# Altium schematic sheet main.SchDoc
size A4; SheetNumber: 1; SheetTotal: 1
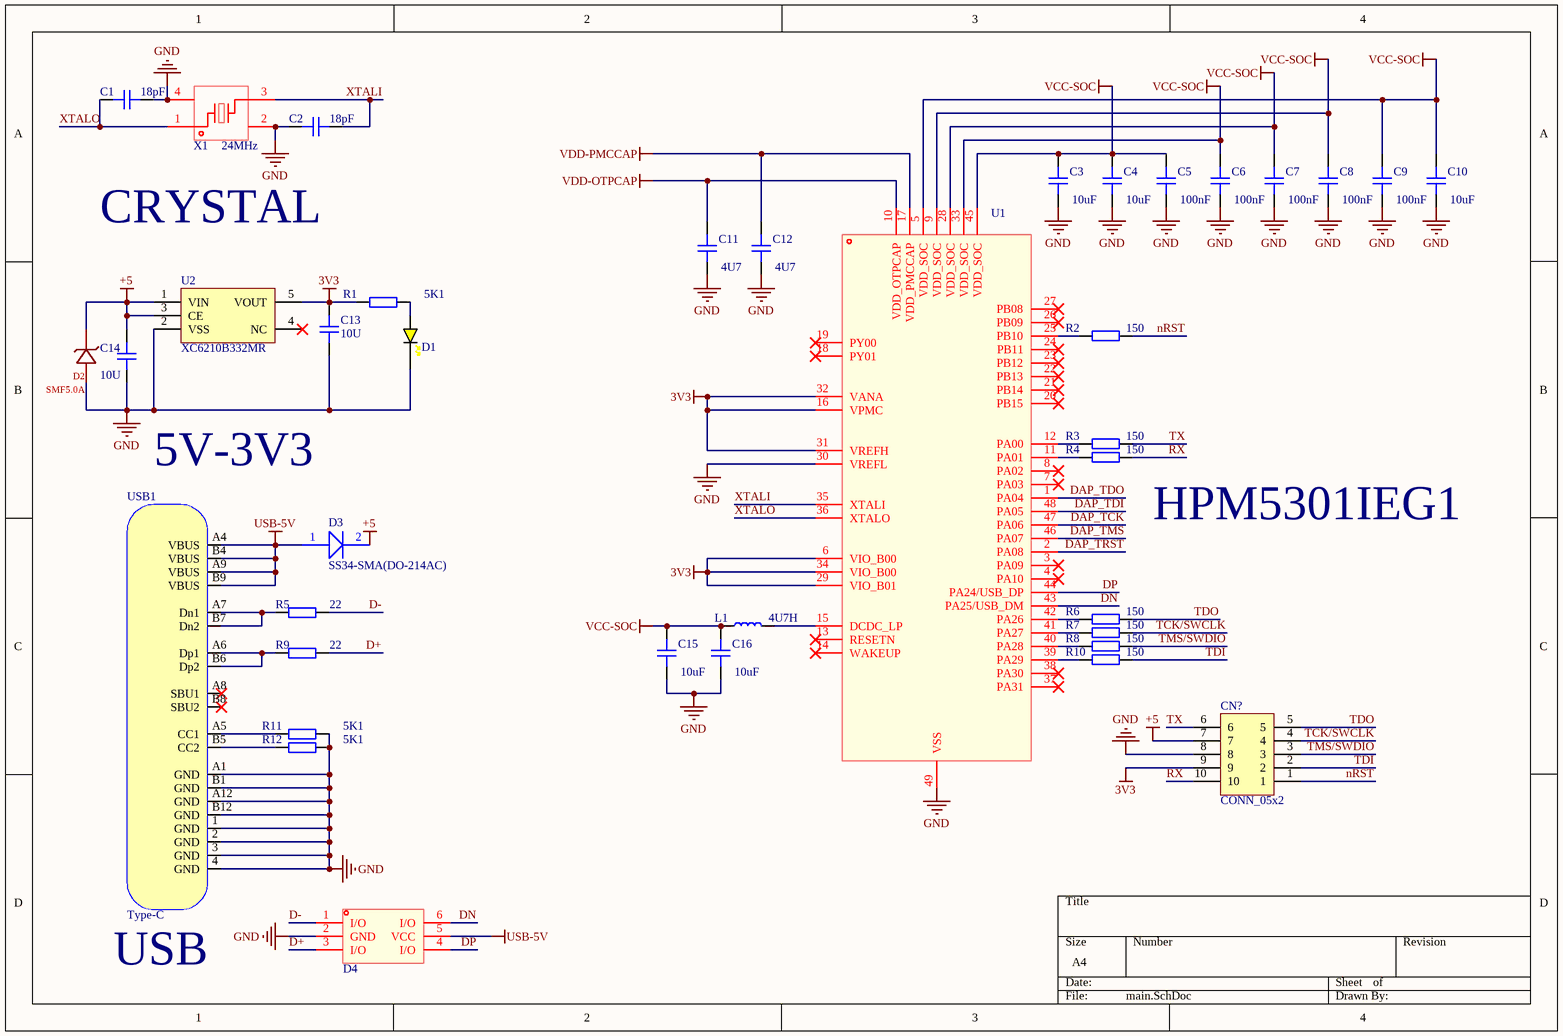
[diagram p0: main.SchDoc]

## Parts
C1  18pF  [CAP_0402]
C2  18pF  [CAP_0402]
C3  10uF  [CAP_0402]
C4  10uF  [CAP_0402]
C5  100nF  [CAP_0402]
C6  100nF  [CAP_0402]
C7  100nF  [CAP_0402]
C8  100nF  [CAP_0402]
C9  100nF  [CAP_0402]
C10  10uF  [CAP_0402]
C11  4U7  [CAP_0402]
C12  4U7  [CAP_0402]
C13  10U  [CAP_0402]
C14  10U  [CAP_0402]
C15  10uF  [CAP_0402]
C16  10uF  [CAP_0402]
CN?  CONN_05x2  [CONN_05x2_2.54_SMD]
D1  YELLOW  [LED_0402_YELLOW]  (value not drawn)
D2  SMF5.0A  [SOD-123FL_L2.7-W1.8-LS3.8-RD]
D3  SS34-SMA(DO-214AC)  [SMA_L4.3-W2.6-LS5.0-FD]
D4  BST236A054U  [SOT-23-6_L2.9-W1.6-P0.95-LS2.9-BL]  (value not drawn)
L1  4U7H  [IND_1008]
R1  5K1  [RES_0402]
R2  150  [RES_0402]
R3  150  [RES_0402]
R4  150  [RES_0402]
R5  22  [RES_0402]
R6  150  [RES_0402]
R7  150  [RES_0402]
R8  150  [RES_0402]
R9  22  [RES_0402]
R10  150  [RES_0402]
R11  5K1  [RES_0402]
R12  5K1  [RES_0402]
U1  HPM5301IEG1  [QFN-48_L6.0-W6.0-P0.40-TL-EP4.2]  (value not drawn)
U2  XC6210B332MR  [SOT-23-5]
USB1  Type-C  [TYPE-C_16P]
X1  24MHz  [CRYSTAL-SMD_4P-L2.5-W2.0-BL-A]

## Nets
3V3: C13.2 CN?.9 R1.1 U1.6(VIO_B00) U1.16(VPMC) U1.29(VIO_B01) U1.31(VREFH) U1.32(VANA) U1.34(VIO_B00) U2.5(VOUT)
+5: C14.2 CN?.7 D2.1(K) D3.2 U2.1(VIN) U2.3(CE)
GND: C1.1 C2.2 C3.1 C4.1 C5.1 C6.1 C7.1 C8.1 C9.1 C10.1 C11.1 C12.1 C13.1 C14.1 C15.1 C16.1 CN?.8 D1.K D2.2(A) D4.2(GND) R11.2 R12.2 U1.30(VREFL) U1.49(VSS) U2.2(VSS) USB1.1(GND) USB1.2(GND) USB1.3(GND) USB1.4(GND) USB1.A1(GND) USB1.A12(GND) USB1.B1(GND) USB1.B12(GND) X1.2(GND) X1.4(GND)
USB-5V: D3.1 D4.5(VCC) USB1.A4(VBUS) USB1.A9(VBUS) USB1.B4(VBUS) USB1.B9(VBUS)
VCC-SOC: C3.2 C4.2 C5.2 C6.2 C7.2 C8.2 C9.2 C10.2 C15.2 C16.2 L1.1 U1.5(VDD_SOC) U1.9(VDD_SOC) U1.28(VDD_SOC) U1.33(VDD_SOC) U1.45(VDD_SOC)
VDD-OTPCAP: C11.2 U1.10(VDD_OTPCAP)
VDD-PMCCAP: C12.2 U1.17(VDD_PMCCAP)
D+: D4.3(I/O) R9.2
D-: D4.1(I/O) R5.2
DAP_TCK: U1.47(PA06)
DAP_TDI: U1.48(PA05)
DAP_TDO: U1.1(PA04)
DAP_TMS: U1.46(PA07)
DAP_TRST: U1.2(PA08)
DN: D4.6(I/O) U1.43(PA25/USB_DM)
DP: D4.4(I/O) U1.44(PA24/USB_DP)
nRST: CN?.1 R2.2
RX: CN?.10 R4.2
TCK/SWCLK: CN?.4 R7.2
TDI: CN?.2 R10.2
TDO: CN?.5 R6.2
TMS/SWDIO: CN?.3 R8.2
TX: CN?.6 R3.2
XTALI: C2.1 U1.35(XTALI) X1.3
XTALO: C1.2 U1.36(XTALO) X1.1
NetD1_A: D1.A R1.2
NetL1_2: L1.2 U1.15(DCDC_LP)
NetR2_1: R2.1 U1.25(PB10)
NetR3_1: R3.1 U1.12(PA00)
NetR4_1: R4.1 U1.11(PA01)
NetR5_1: R5.1 USB1.A7(Dn1) USB1.B7(Dn2)
NetR6_1: R6.1 U1.42(PA26)
NetR7_1: R7.1 U1.41(PA27)
NetR8_1: R8.1 U1.40(PA28)
NetR9_1: R9.1 USB1.A6(Dp1) USB1.B6(Dp2)
NetR10_1: R10.1 U1.39(PA29)
NetR11_1: R11.1 USB1.A5(CC1)
NetR12_1: R12.1 USB1.B5(CC2)

Not connected (* = marked no-connect by the designer): U1 3(PA09)* 4(PA10)* 7(PA03)* 8(PA02)* 13(RESETN)* 14(WAKEUP)* 18(PY01)* 19(PY00)* 20(PB15)* 21(PB14)* 22(PB13)* 23(PB12)* 24(PB11)* 26(PB09)* 27(PB08)* 37(PA31)* 38(PA30)*; U2 4(NC)*; USB1 A8(SBU1)* B8(SBU2)*

## Notes on the sheet
- CRYSTAL
- 5V-3V3
- HPM5301IEG1
- USB

## Library data of the parts
C1-C16 = CAP_0402: Capacitor SMD 0402; Manufacturer: *; Manufacturer Part Number: *; Distributor Link: *; LCSC: *; Rating: *; Dielectric: *
CN? = CONN_05x2: CONN_05x2 2.54MM
D1 = LED_0402_YELLOW: LED 0402 YELLOW SMD
D2 = SMF5.0A_C19077497: 极性:单向;反向截止电压(Vrwm):5V;钳位电压:9.2V;峰值脉冲电流(Ipp):21.7A@10/1000us;峰值脉冲功率(Ppp):200W@10/1000us;击穿电压:7V;; Manufacturer: R+O(宏嘉诚); AddInBom: yes; ModelId: 86f9151e155e4fe2af0c4f2e0a80302e聨0819f05c4eef4c71ace90d822a990e87; ModelName: SOD-123FL_L2.8-W1.8-H1.1-LS3.6; ModelTransform: 141.732,70.866,0,180,0,0,0,0,0; Polarity: 单向; Reverse Stand-Off Voltage (Vrwm): 5V; Clamping Voltage: 9.2V; Voltage - Breakdown: 7V; Reverse Leakage Current (Ir): 400uA; Number of Channels: 单路; level of protection: IEC 61000-4-2; Type: TVS; Symbol: SMF5.0A_C19077497; Device: SMF5.0A_C19077497; LCSC Part Name: 单向TVS 5V截止 峰值浪涌电流：21.7A@10/1000us; SupplierPart: C19077497; ManufacturerPart: SMF5.0A; Supplier Footprint: SOD-123FL; JLCPCB Part Class: Extended Part; Datasheet: https://item.szlcsc.com/datasheet/SMF5.0A/20275582.html; Supplier: LCSC; ConvertToPcb: yes; FootprintName: SOD-123FL_L2.7-W1.8-LS3.8-RD; Peak Pulse Current (Ipp): 21.7A@10/1000us; Peak Pulse Power Dissipation (Ppp): 200W@10/1000us; Operating Temperature: -55℃~+150℃; Junction Capacitance: -
D3 = SS34-SMA(DO-214AC): 40V@3A
D4 = BST236A054U: 极性:-;反向截止电压(Vrwm):5V;钳位电压:13V;峰值脉冲电流(Ipp):3.5A;峰值脉冲功率(Ppp):45W@8/20us;击穿电压:6V;; Manufacturer: BORN(伯恩半导体); NPNP_COMPONENT_ID: C406203; Clamping Voltage: 13V; Junction Capacitance: 0.2pF；0.36pF; Number of Channels: 四路; Peak Pulse Current (Ipp): 3.5A; Reverse Leakage Current (Ir): 500nA; Reverse Stand-Off Voltage (Vrwm): 5V; Type: ESD; Voltage - Breakdown: 6V; level of protection: IEC 61000-4-4；IEC 61000-4-5；IEC 61000-4-2; Footprint: SOT-23-6_L2.9-W1.6-P0.95-LS2.8-BR; Datasheet: https://item.szlcsc.com/datasheet/BST236A054U/393966.html; JLCPCB Part Class: Extended Part; LCSC Part Name: ESD 5V截止 峰值浪涌电流：3.5A; Manufacturer Part: BST236A054U; Peak Pulse Power Dissipation (Ppp): 45W@8/20us; Supplier: LCSC; Supplier Footprint: SOT-23-6; Supplier Part: C406203
L1 = IND_1008: Inductor SMD 1008
R1-R12 = RES_0402: Resistor SMD 0402; Manufacturer: *; Manufacturer Part Number: *; Distributor Link: *; LCSC: *
U1 = HPM5301IEG1_C49451864: 特性：支持 RV32-IMAFDCBP 指令集。 3.57 Coremark/MHz, 1.98 DMIPS/MHz。 DSP 单元，支持 SIMD 和 DSP 指令。 L1 指令缓存和数据缓存各 16KB。 指令本地存储器 ILM 和数据本地存储器 DLM 各 128KB。 共 288KB 片上 SRAM，包括通用内存和 CPU 的本地存储器; Manufacturer: HPMICRO(先楫半导体); NPNP_COMPONENT_ID: C49451864; Datasheet: https://item.szlcsc.com/datasheet/HPM5301IEG1/51998746.html; JLCPCB Part Class: Extended Part; LCSC Part Name: 基于RISC-V内核的32位高性能微控制器; Manufacturer Part: HPM5301IEG1; Supplier: LCSC; Supplier Footprint: QFN-48(6x6); Supplier Part: C49451864
U2 = XC6210B332MR: LDO 3V3@700mA
USB1 = USB-Type-C: USB-Type-C_16P
X1 = XTAL_2520_24MHz: 晶振类型:贴片晶振;频率:24MHz;常温频差:±10ppm;负载电容:18pF;频率稳定度:±10ppm;; Manufacturer: HCI(杭晶); Manufacturer Part: XC22M4-32.000-F08NNHP; NPNP_COMPONENT_ID: C2842280; Equivalent Series Resistance(ESR): 60Ω; Frequency Stability: ±10ppm; Load Capacitance: 8pF; Value: 32MHz; Datasheet: https://item.szlcsc.com/datasheet/XC22M4-32.000-F08NNHP/3026554.html; JLCPCB Part Class: Extended Part; LCSC Part Name: 2520 4P 32MHz 8pF ±10ppm -20~+70℃ (±10ppm); Normal temperature Frequency Tolerance: ±10ppm; Operating Temperature: -20℃~+70℃; Supplier: LCSC; Supplier Footprint: SMD2520-4P; Supplier Part: C2842280; Type: 贴片晶振